# EAGLE schematic Big_Button_Circuit (EAGLE 6.5.0)
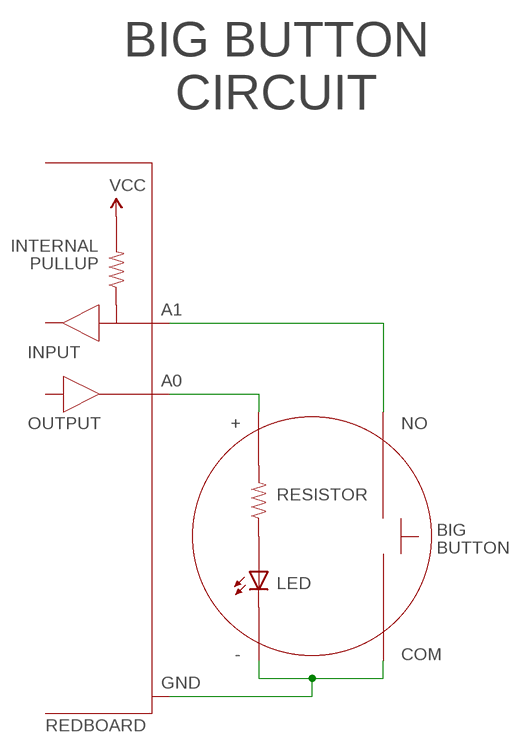
[diagram p0: schematic, sheet 1]

## Parts
INTERNAL  RESISTORPTH-1/6W  [1/6W-RES]
LED  LED5MM  [LED5MM]
RESISTOR  RESISTORPTH-1/6W  [1/6W-RES]
Unconnected: INTERNAL.1 INTERNAL.2 LED.A LED.K(C) RESISTOR.1 RESISTOR.2

## Notes on the sheet
- BIG BUTTON
  CIRCUIT
- PULLUP
- A1
- INPUT
- A0
- OUTPUT | + | NO
- BIG
- BUTTON
- - | COM
- GND
- REDBOARD

## Library data of the parts
INTERNAL RESISTOR = SparkFun-Resistors:RESISTOR: Resistor Basic schematic elements and footprints for 0603, 1206, and PTH resistors.
LED = SparkFun-LED:LED: LEDs Standard schematic elements and footprints for 5mm, 3mm, 1206, and 0603 sized LEDs. 5mm - Spark Fun Electronics SKU : COM-00529 (and others)